# EAGLE design FT232-Breakout-v10 (EAGLE 5.11)
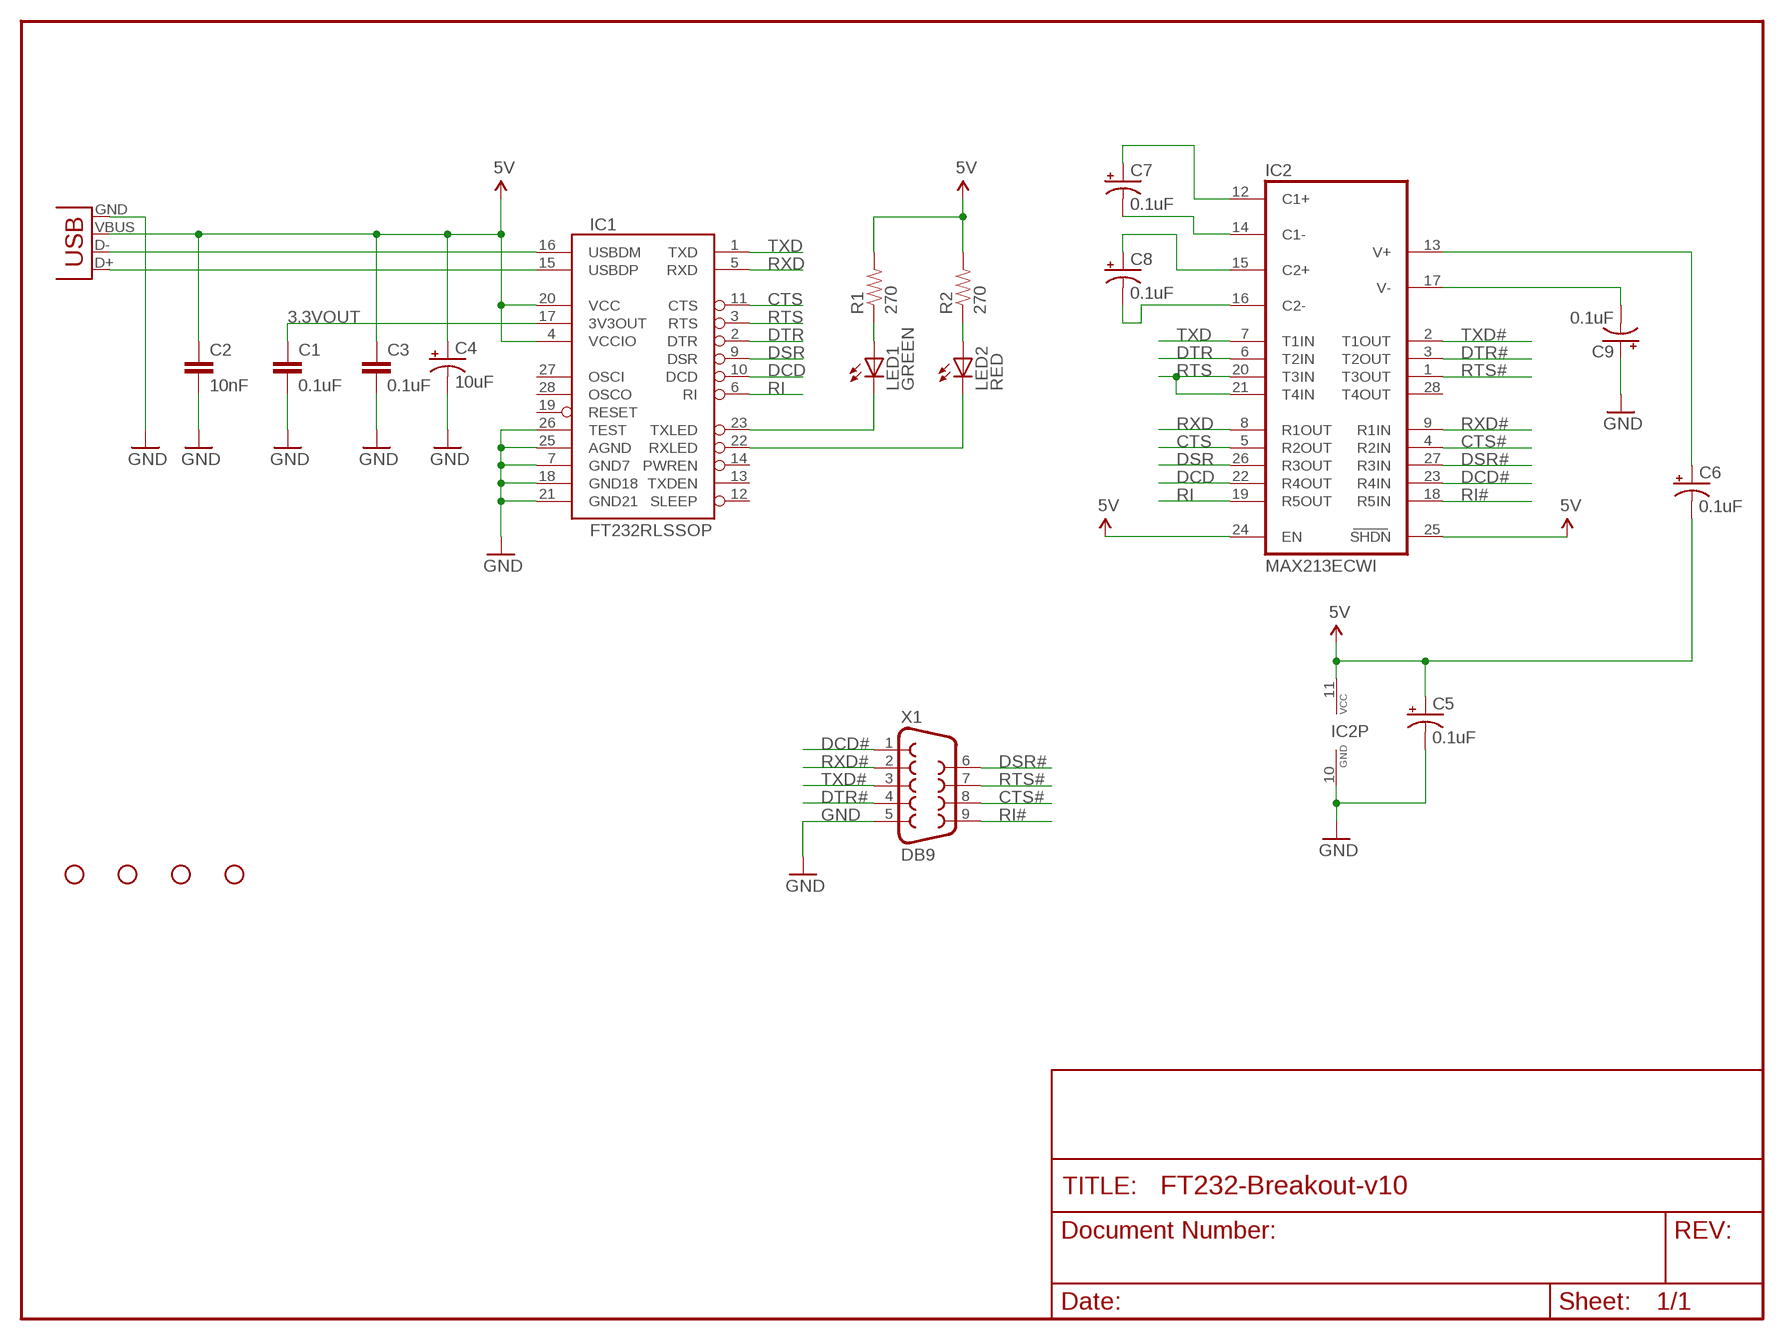
[diagram p0: schematic, sheet 1]

## Parts
C1  0.1uF  CAP0805  [0805]
C2  10nF  CAP0805  [0805]
C3  0.1uF  CAP0805  [0805]
C4  10uF  CAP_POL1206  [EIA3216]
C5  0.1uF  CAP_POL1206  [EIA3216]
C6  0.1uF  CAP_POL1206  [EIA3216]
C7  0.1uF  CAP_POL1206  [EIA3216]
C8  0.1uF  CAP_POL1206  [EIA3216]
C9  0.1uF  CAP_POL1206  [EIA3216]
IC1  FT232RLSSOP  [SSOP28DB]
IC2  MAX213ECWI  [SO28L]
JP1  STAND-OFF  [STAND-OFF]
JP2  STAND-OFF  [STAND-OFF]
JP3  STAND-OFF  [STAND-OFF]
JP4  STAND-OFF  [STAND-OFF]
LED1  GREEN  LED0603  [LED-0603]
LED2  RED  LED0603  [LED-0603]
R1  270  RESISTOR0805-RES  [0805]
R2  270  RESISTOR0805-RES  [0805]
X1  DB9  DB9MALE  [DB9_MALE]
X2  USBPTH  [USB-B-PTH]

## Nets
3.3VOUT: C1.1 IC1.17(3V3OUT)
5V: C2.1 C3.1 C4.A(+) C5.A(+) C6.C(-) IC1.4(VCCIO) IC1.20(VCC) IC2.11(VCC) IC2.24(EN) IC2.25(SHDN) R1.2 R2.2 X2.VBUS
CTS: IC1.11(CTS) IC2.5(R2OUT)
CTS#: IC2.4(R2IN) X1.8
DCD: IC1.10(DCD) IC2.22(R4OUT)
DCD#: IC2.23(R4IN) X1.1
DSR: IC1.9(DSR) IC2.26(R3OUT)
DSR#: IC2.27(R3IN) X1.6
DTR: IC1.2(DTR) IC2.6(T2IN)
DTR#: IC2.3(T2OUT) X1.4
GND: C1.2 C2.2 C3.2 C4.C(-) C5.C(-) C9.A(+) IC1.7(GND7) IC1.18(GND18) IC1.21(GND21) IC1.25(AGND) IC1.26(TEST) IC2.10(GND) X1.5 X2.GND
N$1: IC1.23(TXLED) LED1.C
N$2: IC1.16(USBDM) X2.D-
N$3: IC1.22(RXLED) LED2.C
N$5: LED1.A R1.1
N$6: IC1.15(USBDP) X2.D+
N$7: LED2.A R2.1
N$10: C6.A(+) IC2.13(V+)
N$12: C8.C(-) IC2.16(C2-)
N$13: C8.A(+) IC2.15(C2+)
N$14: C7.C(-) IC2.14(C1-)
N$15: C7.A(+) IC2.12(C1+)
N$16: C9.C(-) IC2.17(V-)
RI: IC1.6(RI) IC2.19(R5OUT)
RI#: IC2.18(R5IN) X1.9
RTS: IC1.3(RTS) IC2.20(T3IN) IC2.21(T4IN)
RTS#: IC2.1(T3OUT) X1.7
RXD: IC1.5(RXD) IC2.8(R1OUT)
RXD#: IC2.9(R1IN) X1.2
TXD: IC1.1(TXD) IC2.7(T1IN)
TXD#: IC2.2(T1OUT) X1.3
Unconnected: IC1.12(SLEEP) IC1.13(TXDEN) IC1.14(PWREN) IC1.19(RESET) IC1.27(OSCI) IC1.28(OSCO) IC2.28(T4OUT)

## Library data of the parts
C1-C3 = SparkFun:CAP: Capacitor Standard 0603 ceramic capacitor, and 0.1" leaded capacitor.
C4-C9 = SparkFun:CAP_POL: Capacitor Polarized These are standard SMD and PTH capacitors. Normally 10uF, 47uF, and 100uF in electrolytic and tantalum varieties. Always verify the external diameter of the through hole cap, it varies with capacity, voltage, and manufacturer. The EIA devices should be standard.
IC1 = SparkFun:FT232RL: USB UART FT232RL 4th Generation USB UART (USB <-> Serial) Controller. Spark Fun Electronics SKU : COM-00650
IC2 = maxim:MAX213ECWI: RS232 TRANSEIVER; MF: MAXIM; MPN: MAX213ECWI+; OC_FARNELL: unknown; OC_NEWARK: 23K5828
JP1-JP4 = SparkFun:STAND-OFF: Stand Off This is the mechanical footprint for a #4 phillips button head screw. Use the keepout ring to avoid running the screw head into surrounding components. SKU : PRT-00447
LED1 LED2 = SparkFun:LED: LEDs Standard schematic elements and footprints for 5mm, 3mm, 1206, and 0603 sized LEDs. 5mm - Spark Fun Electronics SKU : COM-00529 (and others)
R1 R2 = SparkFun:RESISTOR: Resistor Basic schematic elements and footprints for 0603, 1206, and PTH resistors.
X1 = SparkFun:DB9: DB9 Connector Standard DB9 (D-Sub 9) serial connector. Can be used for CAN bus as well as RS485 and RS232. Footprint production proven. Spark Fun Electronics SKU : PRT-00429
X2 = SparkFun:USB: USB Connectors USB-B-PTH is fully proven SKU : PRT-00139 USB-miniB is fully proven SKU : PRT-00587 USB-A-PCB is untested. USB-A-H is throughly reviewed, but untested. Spark Fun Electronics SKU : PRT-00437 USB-B-SMT is throughly reviewed, but untested. Needs silkscreen touching up. USB-A-S has not been used/tested USB-MB-H has not been used/tested

## Net classes
1 gnd: width 0.406 mm

## Board
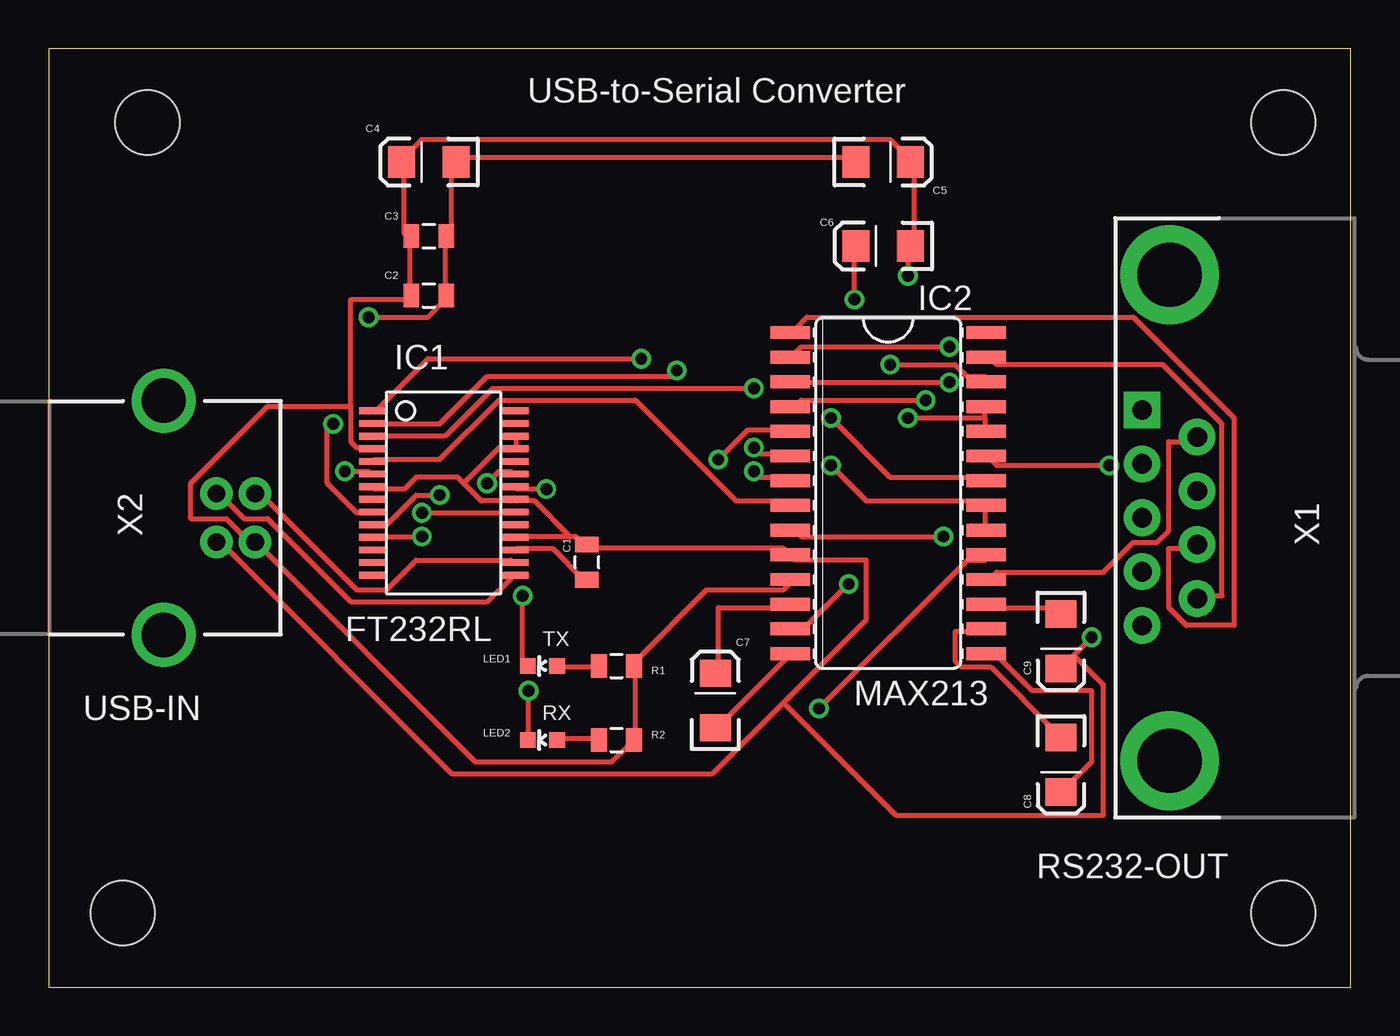
[diagram p1: board, top side]
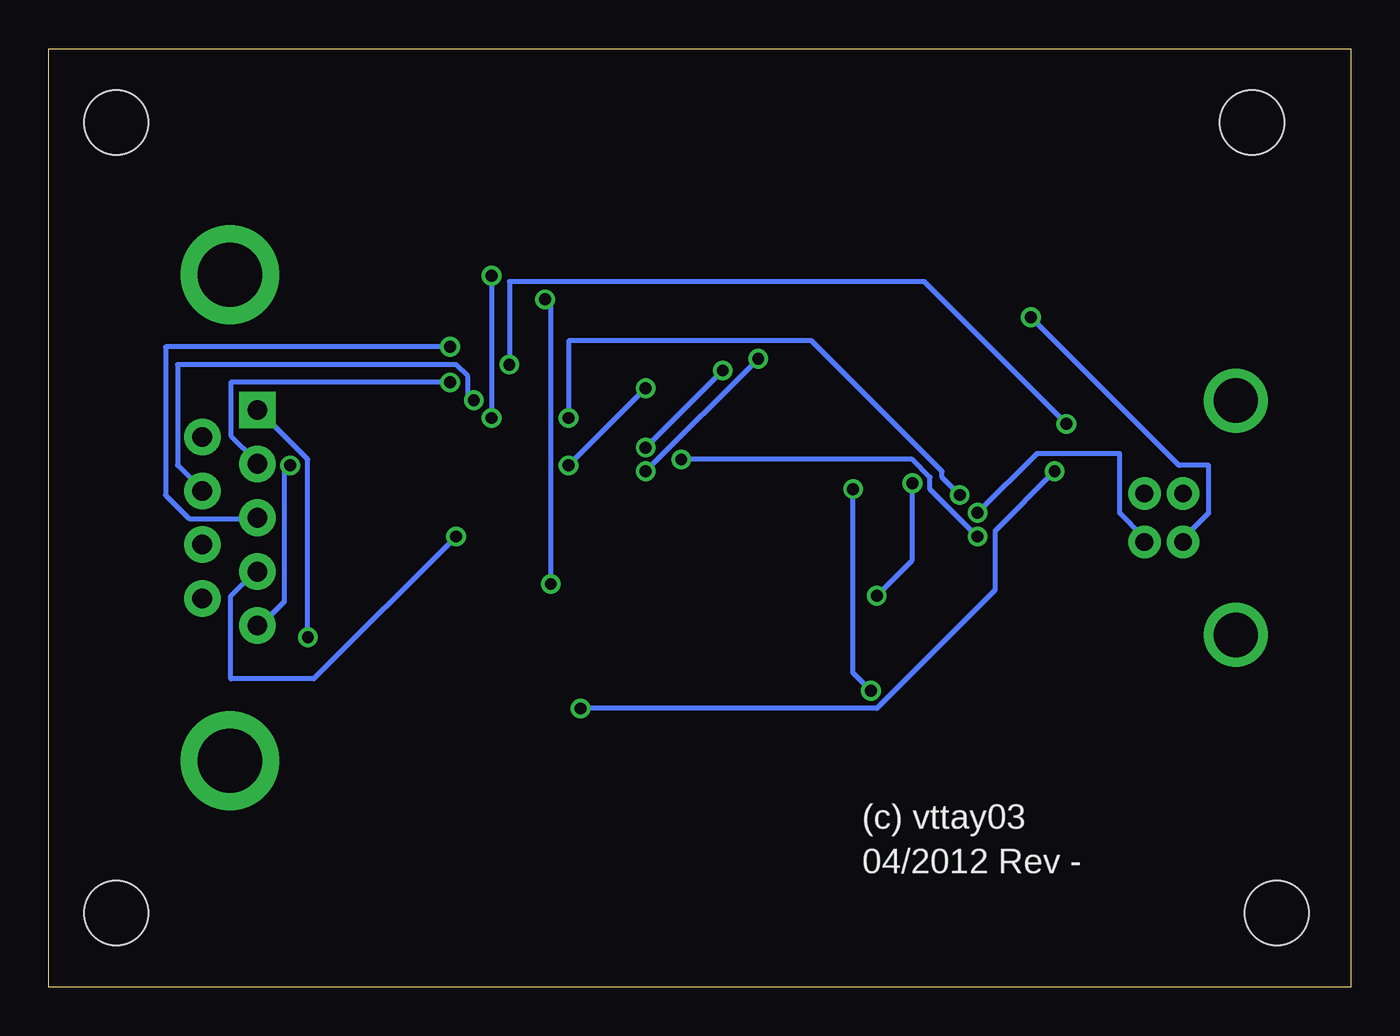
[diagram p2: board, bottom side, seen from below]

Size 66.98 x 48.25 mm. Coordinates in mm from the lower left corner, seen from the top.
Outline: 0,0 66.98,0 66.98,48.25 0,48.25 0,0
Copper layers (1*16): Top 0.035mm / dielectric 1.5mm / Bottom 0.035mm
Design rules "default": minimum track width 10mil, minimum drill 24mil, track to track 8mil, track to pad 8mil, pad to pad 8mil, via to via 8mil, smd to smd 8mil, copper to edge 40mil, drill to drill 8mil, minimum pad ring 10mil, minimum via ring 8mil, stop-mask expansion 4mil, vias tented up to drill 0mil, thermal gap 10mil

### Footprints (pad centres in the part's own frame; a part is rotated, then mirrored left to right if it is on the bottom)
0805 = smd 0.8 x 1.2: 1 -0.9,0; 2 0.9,0
EIA3216 = smd 1.4 x 1.6: A 1.4,0; C -1.4,0
SSOP28DB = smd 0.348 x 1.397: 1 -4.225,-3.656; 2 -3.575,-3.656; 3 -2.925,-3.656; 4 -2.275,-3.656; 5 -1.625,-3.656; 6 -0.975,-3.656; 7 -0.325,-3.656; 8 0.325,-3.656; 9 0.975,-3.656; 10 1.625,-3.656; 11 2.275,-3.656; 12 2.925,-3.656; 13 3.575,-3.656; 14 4.225,-3.656; 15 4.225,3.656; 16 3.575,3.656; 17 2.925,3.656; 18 2.275,3.656; 19 1.625,3.656; 20 0.975,3.656; 21 0.325,3.656; 22 -0.325,3.656; 23 -0.975,3.656; 24 -1.625,3.656; 25 -2.275,3.656; 26 -2.925,3.656; 27 -3.575,3.656; 28 -4.225,3.656
SO28L = smd 0.66 x 2.032: 1 -8.255,-5.029; 2 -6.985,-5.029; 3 -5.715,-5.029; 4 -4.445,-5.029; 5 -3.175,-5.029; 6 -1.905,-5.029; 7 -0.635,-5.029; 8 0.635,-5.029; 9 1.905,-5.029; 10 3.175,-5.029; 11 4.445,-5.029; 12 5.715,-5.029; 13 6.985,-5.029; 14 8.255,-5.029; 15 8.255,5.029; 16 6.985,5.029; 17 5.715,5.029; 18 4.445,5.029; 19 3.175,5.029; 20 1.905,5.029; 21 0.635,5.029; 22 -0.635,5.029; 23 -1.905,5.029; 24 -3.175,5.029; 25 -4.445,5.029; 26 -5.715,5.029; 27 -6.985,5.029; 28 -8.255,5.029
STAND-OFF = hole 3.302: 0,0
LED-0603 = smd 0.8 x 0.8: A 0,-0.75; C 0,0.75
DB9_MALE = drill 1.016 pad 1.88 round: 1 5.54,-1.42; 2 2.77,-1.42; 3 0,-1.42; 4 -2.77,-1.42; 6 4.15,1.42; 7 1.38,1.42; 8 -1.38,1.42; 9 -4.15,1.42 | drill 1.016 pad 1.88 square: 5 -5.54,-1.42 | drill 3.302 pad 5.08 round: G1 -12.5,0; G2 12.5,0
USB-B-PTH = drill 0.914 pad 1.676 round: D+ 0,1.25; D- 1.981,1.25; GND 0,-1.25; VBUS 1.981,-1.25 | drill 2.286 round: S1 -2.718,-6.02; S2 -2.718,6.02

### Placement (x,y rotation side)
C1  27.69,21.84 90 top
C2  19.56,35.56 0 top
C3  19.56,38.61 0 top
C4  19.56,42.42 180 top
C5  42.93,42.42 0 top
C6  42.93,38.1 180 top
C7  34.29,14.73 90 top
C8  52.07,11.43 270 top
C9  52.07,17.78 270 top
IC1  20.32,25.4 270 top
IC2  43.18,25.4 270 top
JP1  3.81,3.81 0 top
JP2  5.08,44.45 0 top
JP3  63.5,44.45 0 top
JP4  63.5,3.81 0 top
LED1  25.4,16.51 90 top
LED2  25.4,12.7 90 top
R1  29.21,16.51 0 top
R2  29.21,12.7 0 top
X1  57.66,24.13 270 top
X2  8.64,24.13 0 top

### Tracks (layer width: path | path; a pad name or v marks a point on that pad's centre or on a via)
3.3VOUT
  Top 0.254: C1.1 27.43,21.03 25.91,22.55 24.08,22.55 IC1.17
5V  (via drill 0.61)
  Top 0.254: 48.16,29.26 48.16,29.57 IC2.25 | 48.16,29.26 48.16,28.65 IC2.24 | v44.2,29.26 48.16,29.26 | v44.2,36.58 44.2,38.1 C6.C 44.5,38.1 44.5,42.37 C5.A 44.2,42.67 43.28,43.59 19.2,43.59 18.29,42.67 C4.A 18.29,42.37 18.29,38.71 18.59,38.71 C3.1 18.59,38.41 18.59,35.66 C2.1 18.59,35.36 15.54,35.36 15.54,29.87 | IC2.11 38.1,20.73 37.8,20.42 33.83,20.42 30.18,16.76 R1.2 30.18,16.46 30.18,12.8 R2.2 29.87,12.5 28.96,11.58 21.95,11.58 10.67,22.86 X2.VBUS 10.36,23.16 10.06,23.16 9.14,24.08 7.32,24.08 7.32,25.91 11.28,29.87 15.54,29.87 | 15.54,29.87 15.54,28.04 15.85,27.74 16.46,27.74 IC1.4 | v19.2,24.38 23.77,24.38 IC1.20
  Bottom 0.254: v44.2,36.58 v44.2,29.26 | v19.2,24.38 16.15,27.43 11.89,27.43 11.89,24.38 10.67,23.16 X2.VBUS
CTS  (via drill 0.61)
  Top 0.254: v19.2,23.16 16.76,23.16 IC1.11 | v34.44,27.13 35.97,28.65 38.1,28.65 IC2.5
  Bottom 0.254: v19.2,23.16 21.64,25.6 21.64,26.21 22.55,27.13 v34.44,27.13
CTS#  (via drill 0.61)
  Top 0.254: v45.11,30.18 38.71,30.18 38.41,29.87 IC2.4
  Bottom 0.254: v45.11,30.18 45.41,30.48 45.41,31.39 46.02,32 60.35,32 60.35,26.82 59.13,25.6 X1.8
DCD  (via drill 0.61)
  Top 0.254: v20.12,25.3 18.9,25.3 17.37,23.77 16.76,23.77 IC1.10 | v40.23,29.26 43.28,26.21 48.16,26.21 IC2.22
  Bottom 0.254: v20.12,25.3 21.03,26.21 21.03,26.52 27.74,33.22 40.23,33.22 v40.23,29.26
DCD#  (via drill 0.61)
  Top 0.254: v54.56,26.82 48.77,26.82 48.46,27.13 IC2.23
  Bottom 0.254: v54.56,26.82 54.86,26.52 54.86,19.81 56.08,18.59 X1.1
DSR  (via drill 0.61)
  Top 0.254: v14.63,28.96 14.33,28.96 14.33,25.91 15.85,24.38 16.46,24.38 IC1.9 | v43.28,32 46.63,32 47.24,31.39 48.16,31.39 IC2.26
  Bottom 0.254: v14.63,28.96 21.95,36.27 43.28,36.27 v43.28,32
DSR#
  Top 0.254: IC2.27 48.46,32.31 48.77,32 57.3,32 60.35,28.96 60.35,20.12 59.13,20.12 X1.6
DTR  (via drill 0.61)
  Top 0.254: v32.31,31.7 32,31.39 22.55,31.39 20.12,28.96 16.76,28.96 IC1.2 | v36.27,27.74 36.58,27.43 38.1,27.43 IC2.6
  Bottom 0.254: v32.31,31.7 v36.27,27.74
DTR#  (via drill 0.61)
  Top 0.254: v46.33,31.09 38.41,31.09 IC2.3
  Bottom 0.254: v46.33,31.09 57.61,31.09 57.61,28.35 56.39,27.13 X1.4
GND  (via drill 0.61)
  Top 0.254: C5.C 41.45,42.67 21.03,42.67 C4.C 20.73,42.37 20.73,38.71 C3.2 20.42,38.41 20.42,35.66 C2.2 20.42,35.36 19.51,34.44 v16.46,34.44 | 52.73,17.07 v53.65,17.98 | 52.73,17.07 52.12,16.46 C9.A 52.73,17.07 | IC1.26 24.08,28.35 24.08,27.74 IC1.25 23.77,27.74 23.16,27.74 21.34,25.91 | 26.82,23.16 24.08,23.16 IC1.18 | 26.82,23.16 27.13,23.16 27.43,22.86 C1.2 27.74,22.55 37.8,22.55 38.1,22.25 IC2.10 38.41,21.95 42.06,21.95 42.06,18.9 37.8,14.63 | 26.82,23.16 24.99,24.99 24.08,24.99 IC1.21 23.77,24.99 22.25,24.99 21.34,25.91 | 21.34,25.91 21.03,26.21 18.9,26.21 18.29,25.6 16.76,25.6 IC1.7 | 37.8,14.63 34.14,10.97 20.73,10.97 8.84,22.86 X2.GND | 52.73,17.07 54.25,15.54 54.25,8.84 43.59,8.84 37.8,14.63
  Bottom 0.254: v53.65,17.98 53.65,27.13 56.08,29.57 X1.5 | v16.46,34.44 8.84,26.82 7.32,26.82 7.32,24.38 8.53,23.16 X2.GND
N$1  (via drill 0.61)
  Top 0.254: v24.38,20.12 24.38,16.76 LED1.C | v22.55,25.91 23.16,26.52 23.77,26.52 IC1.23
  Bottom 0.254: v24.38,20.12 22.55,21.95 v22.55,25.91
N$2
  Top 0.254: IC1.16 23.77,21.95 18.9,21.95 17.37,20.42 15.85,20.42 10.97,25.3 10.67,25.3 X2.D-
N$3  (via drill 0.61)
  Top 0.254: v24.69,15.24 24.69,12.8 LED2.C | v25.6,25.6 24.08,25.6 IC1.22
  Bottom 0.254: v24.69,15.24 25.6,16.15 v25.6,25.6
N$5
  Top 0.254: LED1.A 26.21,16.46 28.04,16.46 R1.1
N$6
  Top 0.254: IC1.15 23.77,21.03 22.55,19.81 15.54,19.81 11.28,24.08 10.06,24.08 8.84,25.3 X2.D+
N$7
  Top 0.254: LED2.A 26.21,12.8 28.04,12.8 R2.1
N$10  (via drill 0.61)
  Top 0.254: v41.45,35.36 41.45,38.1 C6.A | v41.15,20.73 39.01,18.59 38.41,18.59 IC2.13
  Bottom 0.254: v41.45,35.36 41.15,35.05 v41.15,20.73
N$12
  Top 0.254: C8.C 51.82,13.11 48.46,16.46 46.94,16.46 46.63,16.76 46.63,18.29 48.16,18.29 IC2.16
N$13
  Top 0.254: C8.A 52.12,10.06 53.65,11.58 53.65,15.24 50.6,15.24 48.77,17.07 48.46,17.07 IC2.15
N$14
  Top 0.254: C7.C 34.44,13.41 38.1,17.07 IC2.14
N$15
  Top 0.254: C7.A 34.44,16.15 34.44,19.51 38.1,19.51 IC2.12
N$16
  Top 0.254: C9.C 51.82,19.2 51.51,19.51 48.46,19.51 IC2.17
RI  (via drill 0.61)
  Top 0.254: v15.24,26.52 16.46,26.52 IC1.6 | v39.62,14.33 47.24,21.95 48.16,21.95 IC2.19
  Bottom 0.254: v15.24,26.52 18.29,23.47 18.29,20.42 24.38,14.33 v39.62,14.33
RI#
  Top 0.254: IC2.18 48.46,21.03 48.77,21.34 54.25,21.34 55.78,22.86 57,22.86 57.61,23.47 57.61,28.04 58.83,28.04 X1.9
RTS  (via drill 0.61)
  Top 0.254: v36.27,30.79 22.86,30.79 20.42,28.35 16.76,28.35 IC1.3 | v40.23,26.82 42.06,24.99 48.16,24.99 IC2.21 48.16,24.69 48.16,23.77 IC2.20
  Bottom 0.254: v36.27,30.79 v40.23,26.82
RTS#
  Top 0.254: IC2.1 38.41,33.83 39.01,34.44 55.78,34.44 60.96,29.26 60.96,18.59 58.52,18.59 57.61,19.51 57.61,22.55 58.83,22.55 X1.7
RXD
  Top 0.254: IC1.5 16.76,27.13 20.12,27.13 23.16,30.18 30.18,30.18 35.36,24.99 38.1,24.99 IC2.8
RXD#  (via drill 0.61)
  Top 0.254: v46.02,23.16 38.71,23.16 38.41,23.47 IC2.9
  Bottom 0.254: v46.02,23.16 53.34,15.85 57.61,15.85 57.61,20.12 56.39,21.34 X1.2
TXD  (via drill 0.61)
  Top 0.254: v30.48,32.31 19.51,32.31 16.76,29.57 IC1.1 | v36.27,26.52 36.58,26.21 38.1,26.21 IC2.7
  Bottom 0.254: v30.48,32.31 v36.27,26.52
TXD#  (via drill 0.61)
  Top 0.254: v46.33,32.92 38.71,32.92 38.41,32.61 IC2.2
  Bottom 0.254: v46.33,32.92 60.96,32.92 60.96,25.3 59.74,24.08 56.39,24.08 X1.3

### Text on the board
tPlace: USB-to-Serial Converter | FT232RL | TX | USB-IN | RX | MAX213 | RS232-OUT
bPlace: (c) vttay03 | 04/2012 Rev -